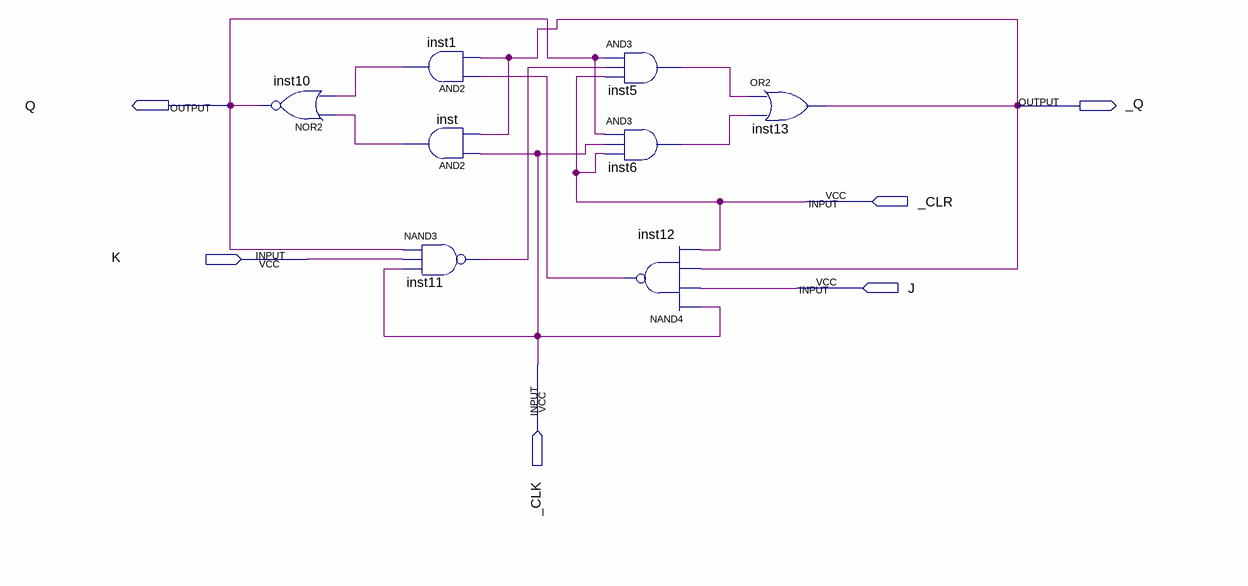
[diagram p0: schematic sheet]
// Quartus schematic JK_FF.bdf as structural Verilog: 8 symbols, 6 pins
module JK_FF (
  input  _CLR,
  input  K,
  input  J,
  input  _CLK,
  output Q,
  output _Q
);

  wire inst1_out, inst5_out, inst6_out, inst11_out, inst12_out, inst_out;

  nor inst10 (Q, inst_out, inst1_out);
  and inst1 (inst1_out, inst12_out, _Q);
  and inst (inst_out, _CLK, _Q);
  nand inst11 (inst11_out, Q, K, _CLK);
  and inst5 (inst5_out, Q, inst11_out, _CLR);
  and inst6 (inst6_out, Q, _CLK, _CLR);
  nand inst12 (inst12_out, _CLK, J, _Q, _CLR);
  or inst13 (_Q, inst5_out, inst6_out);
endmodule
